# EAGLE design Tiny_BLE_V1.0 (EAGLE 6.4)
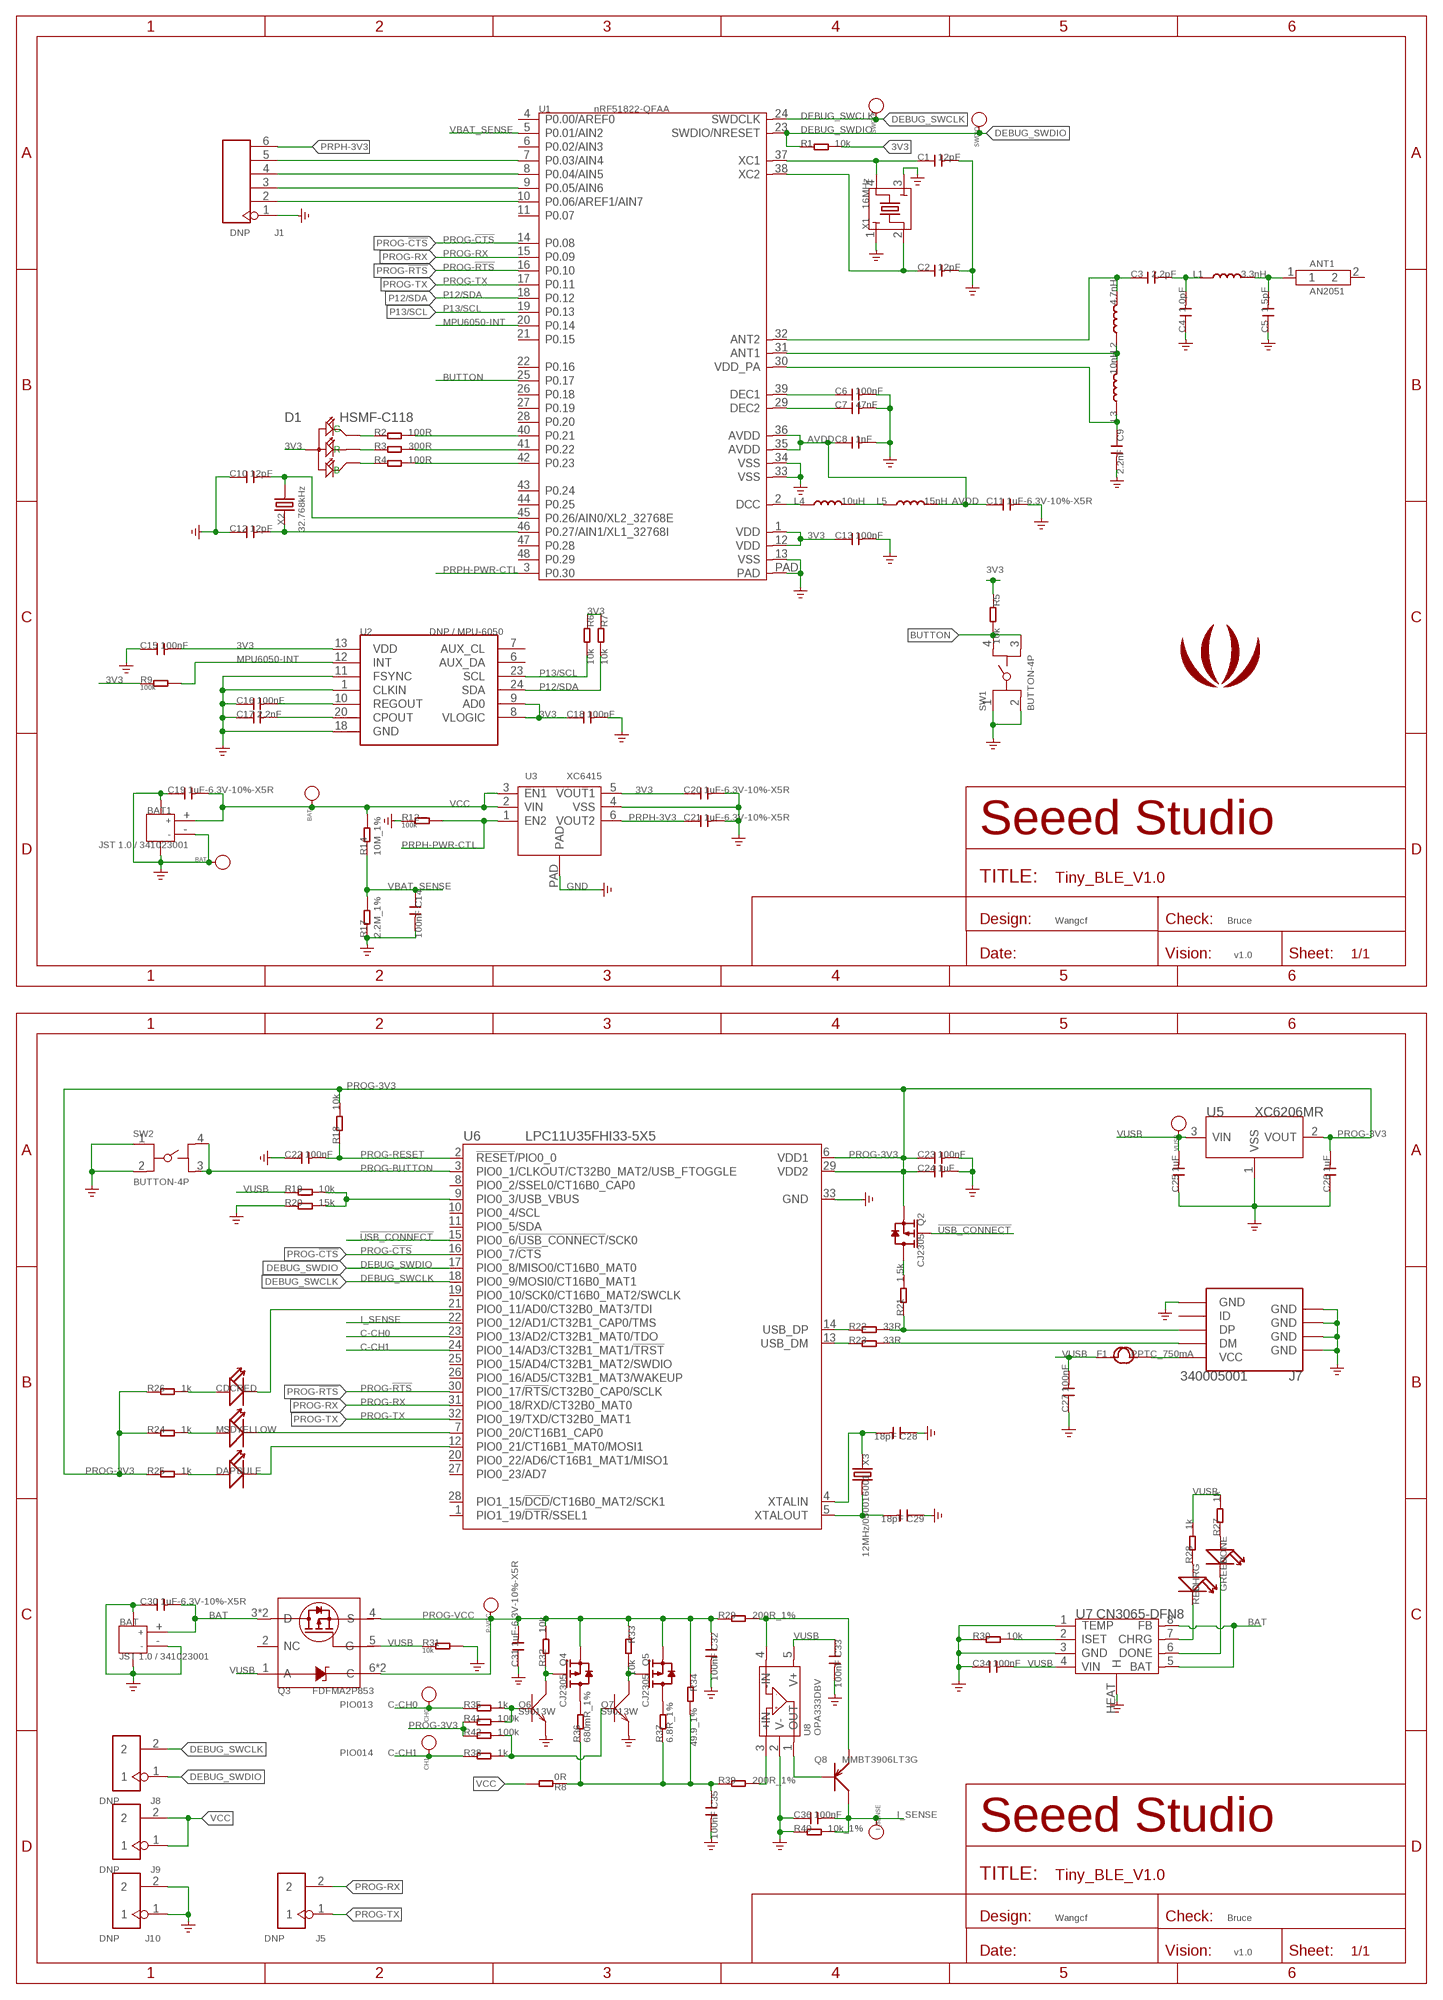
[diagram p0: schematic, sheet 1]

## Parts
ANT1  AN2051  ANTENNA-2.4GHZ-0.5DBI'AN2051'  [2P-SMD-L5.05*W.02*H1.07MM]
BAT  JST 1.0 / 341023001  JACK-JST-2P-SMD-PW'1.0'  [JST-SMD-2P-1.0-90D]
BAT1  JST 1.0 / 341023001  JACK-JST-2P-SMD-PW'1.0'  [JST-SMD-2P-1.0-90D]
BAT+  BAT+  PAD-TEST-POINT'4080'  [PAD_4080]
BAT-  BAT-  PAD-TEST-POINT'4080'  [PAD_4080]
C1  12pF  C-0402  [C0402]
C2  12pF  C-0402  [C0402]
C3  2.2pF  C-0402  [C0402]
C4  1.0pF  C-0402  [C0402]
C5  1.5pF  C-0402  [C0402]
C6  100nF  C-0402  [C0402]
C7  47nF  C-0402  [C0402]
C8  1nF  C-0402  [C0402]
C9  2.2nF  C-0402  [C0402]
C10  12pF  C-0402  [C0402]
C11  1uF-6.3V-10%-X5R  C-0402  [C0402]
C12  12pF  C-0402  [C0402]
C13  100nF  C-0402  [C0402]
C14  100nF  C-0402  [C0402]
C15  100nF  C-0402  [C0402]
C16  100nF  C-0402  [C0402]
C17  2.2nF  C-0402  [C0402]
C18  100nF  C-0402  [C0402]
C19  1uF-6.3V-10%-X5R  C-0402  [C0402]
C20  1uF-6.3V-10%-X5R  C-0402  [C0402]
C21  1uF-6.3V-10%-X5R  C-0402  [C0402]
C22  100nF  C-0402  [C0402]
C23  100nF  C-0402  [C0402]
C24  1uF  C-0402  [C0402]
C25  1uF  C-0402  [C0402]
C26  1uF  C-0402  [C0402]
C27  100nF  C-0402  [C0402]
C28  18pF  C-0402  [C0402]
C29  18pF  C-0402  [C0402]
C30  1uF-6.3V-10%-X5R  C-0402  [C0402]
C31  1uF-6.3V-10%-X5R  C-0402  [C0402]
C32  100nF  C-0402  [C0402]
C33  100nF  C-0402  [C0402]
C34  100nF  C-0402  [C0402]
C35  100nF  C-0402  [C0402]
C36  100nF  C-0402  [C0402]
CDC  RED  LED'0603'  [LED-0603]
CH0  CH0  PAD-TEST-POINT'4545'  [TP_4545]
CH1  CH1  PAD-TEST-POINT'4545'  [TP_4545]
CHRG  RED  LED'0603'  [LED-0603]
D1  HSMF-C118  LED-ARGB-4P-1210  [LED-4P-1210-3.0X2.54]
DAP  BULE  LED'0603'  [LED-0603]
DONE  GREEN  LED'0603'  [LED-0603]
F1  PPTC_750mA  FUSE'1206'  [F1206]
I_SENSE  I_SENSE  PAD-TEST-POINT'4545'  [TP_4545]
J1  DNP  HEADER-6P-60/35MIL  [6P-2.54-60/35MIL]
J5  DNP  HEADER-2P-65/35MIL  [2P-2.54-65/35MIL]
J7  340005001  USB-MINIUSB-5P-MICRO  [MICRO-USB]
J8  DNP  HEADER-2P-65/35MIL  [2P-2.54-65/35MIL]
J9  DNP  HEADER-2P-65/35MIL  [2P-2.54-65/35MIL]
J10  DNP  HEADER-2P-65/35MIL  [2P-2.54-65/35MIL]
L1  3.3nH  L'0402'  [L0402]
L2  4.7nH  L'0402'  [L0402]
L3  10nH  L'0402'  [L0402]
L4  10uH  L'0603'  [L0603]
L5  15nH  L'0402'  [L0402]
MSD  YELLOW  LED'0603'  [LED-0603]
P-VCC  P_VCC  PAD-TEST-POINT'4545'  [TP_4545]
Q2  CJ2305  MOSFET-P'SI2323CDS/SI2305DS<BR>'  [SOT23]
Q3  FDFMA2P853  [6P-SMD-W/-HEAT]
Q4  CJ2305  MOSFET-P'SI2323CDS/SI2305DS<BR>'  [SOT23]
Q5  CJ2305  MOSFET-P'SI2323CDS/SI2305DS<BR>'  [SOT23]
Q6  S9013W  TRANSISTOR-NPN-SOT323  [SOT323]
Q7  S9013W  TRANSISTOR-NPN-SOT323  [SOT323]
Q8  MMBT3906LT3G  TRANSISTOR-PNP-SOT23  [SOT23]
R1  10k  R-0402  [R0402]
R2  100R  R-0402  [R0402]
R3  300R  R-0402  [R0402]
R4  100R  R-0402  [R0402]
R5  10k  R-0402  [R0402]
R6  10k  R-0402  [R0402]
R7  10k  R-0402  [R0402]
R8  0R  R-0603  [R0603]
R9  100k  R-0402  [R0402]
R12  100k  R-0402  [R0402]
R14  10M_1%  R-0402  [R0402]
R17  2.2M_1%  R-0402  [R0402]
R18  10k  R-0402  [R0402]
R19  10k  R-0402  [R0402]
R20  15k  R-0402  [R0402]
R21  1.5k  R-0402  [R0402]
R22  33R  R-0402  [R0402]
R23  33R  R-0402  [R0402]
R24  1k  R-0402  [R0402]
R25  1k  R-0402  [R0402]
R26  1k  R-0402  [R0402]
R27  1k  R-0402  [R0402]
R28  1k  R-0402  [R0402]
R29  200R_1%  R-0402  [R0402]
R30  10k  R-0402  [R0402]
R31  10k  R-0402  [R0402]
R32  10k  R-0402  [R0402]
R33  10k  R-0402  [R0402]
R34  49.9_1%  R-0603  [R0603]
R35  1k  R-0402  [R0402]
R36  680mR_1%  R-0603  [R0603]
R37  6.8R_1%  R-0603  [R0603]
R38  1k  R-0402  [R0402]
R39  200R_1%  R-0402  [R0402]
R40  10k_1%  R-0402  [R0402]
R41  100k  R-0402  [R0402]
R42  100k  R-0402  [R0402]
SW1  BUTTON-4P  [4P-SMD-L4.45*W3.22*H2.5MM]
SW2  BUTTON-4P  [4P-SMD-L4.45*W3.22*H2.5MM]
SWCLK  SWDCLK  PAD-TEST-POINT'4080'  [PAD_4080]
SWDIO  SWDIO  PAD-TEST-POINT'4080'  [PAD_4080]
U1  nRF51822-QFAA  NRF51822  [QFN48-6X6MM]
U2  DNP / MPU-6050  MPU-6050‘’  [QFN24]
U3  XC6415  [USP-6C]
U5  XC6206MR  [SOT23]
U6  LPC11U35FHI33-5X5  [HVQFN33]
U7  CN3065-DFN8  [DFN8]
U8  OPA333DBV  [SOT23-5]
U$59  LOGO-SEEEDSTUDIO-SMALL-SILK  [SMALL_SEEED_LOGO]
VUSB  VUSB  PAD-TEST-POINT'4545'  [TP_4545]
X1  16MHz  CRYSTAL'-2520'  [2520]
X2  32.768kHz  CRYSTAL-3215  [2P-SMD-3.2X1.5]
X3  12MHz/050016001  CRYSTAL'5032'  [2P-SMD-5X3.2]

## Nets
3V3: C13.1 C15.2 C18.1 C20.1 D1.1(+) R1.2 R5.1 R6.1 R7.1 R9.1 U1.1(VDD) U1.12(VDD) U2.8(VLOGIC) U2.9(AD0) U2.13(VDD) U3.5(VOUT1)
!USB_CONNECT: Q2.1(G) U6.15(PIO0_6/!USB_CONNECT!/SCK0)
AVDD: C8.1 C11.1 L5.2 U1.35(AVDD) U1.36(AVDD)
BAT: BAT.+ C30.2 Q3.3(D) Q3.P2(D) U7.5(BAT) U7.8(FB)
BUTTON: R5.2 SW1.3 SW1.4 U1.25(P0.17)
C-CH0: CH0.T R35.1 U6.23(PIO0_13/AD2/CT32B1_MAT0/TDO)
C-CH1: CH1.T R38.1 U6.24(PIO0_14/AD3/CT32B1_MAT1/!TRST!)
CHRG: CHRG.- U7.7(CHRG)
CHRG-DONE: DONE.- U7.6(DONE)
DCC: L4.1 U1.2(DCC)
DEBUG_SWCLK: J8.2 SWCLK.1(T) U1.24(SWDCLK) U6.18(PIO0_9/MOSI0/CT16B0_MAT1)
DEBUG_SWDIO: J8.1 R1.1 SWDIO.1(T) U1.23(SWDIO/NRESET) U6.17(PIO0_8/MISO0/CT16B0_MAT0)
GND: BAT1.3 BAT1.4 BAT1.- BAT-.1(T) BAT.3 BAT.4 BAT.- C1.2 C2.2 C4.1 C5.1 C6.2 C7.2 C8.2 C9.2 C10.1 C11.2 C12.1 C13.2 C14.2 C15.1 C16.1 C17.1 C18.2 C19.1 C20.2 C21.2 C22.1 C23.2 C24.2 C25.1 C26.1 C27.1 C28.1 C29.1 C30.1 C31.1 C32.2 C33.2 C34.1 C35.2 C36.1 J1.1 J7.5(GND) J7.S1(GND) J7.S2(GND) J7.S3(GND) J7.S4(GND) J7.S5(GND) J7.S6(GND) J10.1 J10.2 Q6.2(E) Q7.2(E) R12.1 R17.1 R20.1 R30.1 R31.2 R40.1 SW1.1 SW1.2 SW2.1 SW2.2 U1.13(VSS) U1.33(VSS) U1.34(VSS) U1.PAD U2.1(CLKIN) U2.11(FSYNC) U2.18(GND) U3.4(VSS) U3.PAD U5.1(VSS) U6.33(GND) U7.1(TEMP) U7.3(GND) U7.HEAT(H) U8.2(V-) X1.1 X1.3 ; supply symbol labelled GND_POWER
I_SENSE: C36.2 I_SENSE.T Q8.3(C) R40.2 U6.22(PIO0_12/AD1/CT32B1_CAP0/TMS)
ISET: R30.2 U7.2(ISET)
MPU6050-INT: R9.2 U1.20(P0.14) U2.12(INT)
N$1: Q8.2(E) R29.2 U8.4(-IN)
N$2: C29.2 U6.5(XTALOUT) X3.2
N$3: D1.3(G) R2.1
N$4: C28.2 U6.4(XTALIN) X3.1
N$5: D1.2(R) R3.1
N$6: R22.1 U6.14(USB_DP)
N$7: R23.1 U6.13(USB_DM)
N$8: J7.3(DP) R21.1 R22.2
N$9: Q4.1(G) Q6.3(C) R32.1
N$11: J7.2(DM) R23.2
N$12: C10.2 U1.45(P0.26/AIN0/XL2_32768E) X2.2
N$13: C12.2 U1.46(P0.27/AIN1/XL1_32768I) X2.1
N$14: C1.1 U1.37(XC1) X1.4
N$15: C2.1 U1.38(XC2) X1.2
N$16: CDC.- U6.21(PIO0_11/AD0/CT32B0_MAT3/TDI)
N$19: C16.2 U2.10(REGOUT)
N$20: C6.1 U1.39(DEC1)
N$21: C17.2 U2.20(CPOUT)
N$25: C7.1 U1.29(DEC2)
N$26: C3.1 L2.2 U1.32(ANT2)
N$28: L2.1 L3.2 U1.31(ANT1)
N$29: C9.1 L3.1 U1.30(VDD_PA)
N$30: C3.2 C4.2 L1.1
N$31: ANT1.1 C5.2 L1.2
N$32: L4.2 L5.1
N$39: Q2.3(D) R21.2
N$40: F1.2 J7.1(VCC)
N$41: R19.2 R20.2 U6.9(PIO0_3/USB_VBUS)
N$42: CDC.+ R26.2
N$43: DAP.+ R25.2
N$44: MSD.+ R24.2
N$46: MSD.- U6.7(PIO0_20/CT16B1_CAP0)
N$47: DAP.- U6.12(PIO0_21/CT16B1_MAT0/MOSI1)
N$78: D1.4(B) R4.1
N$79: Q8.1(B) U8.1(OUT)
N$80: R39.2 U8.3(+IN)
N$81: Q5.3(D) R37.2
N$82: Q4.3(D) R36.2
N$83: Q6.1(B) R35.2 R41.2
N$84: Q5.1(G) Q7.3(C) R33.2
N$85: Q7.1(B) R38.2 R42.2
N$86: DONE.+ R27.1
N$87: CHRG.+ R28.1
N$88: R2.2 U1.40(P0.21)
N$89: R3.2 U1.41(P0.22)
N$90: R4.2 U1.42(P0.23)
N$93: J1.2 U1.10(P0.06/AREF1/AIN7)
N$94: J1.3 U1.9(P0.05/AIN6)
N$95: J1.4 U1.8(P0.04/AIN5)
N$96: J1.5 U1.7(P0.03/AIN4)
N$98: C35.1 R8.1 R34.2 R36.1 R37.1 R39.1
P12/SDA: R7.2 U1.18(P0.12) U2.24(SDA)
P13/SCL: R6.2 U1.19(P0.13) U2.23(SCL)
PROG-3V3: C23.1 C24.1 C26.2 Q2.2(S) R18.2 R24.1 R25.1 R26.1 R41.1 R42.1 U5.2(VOUT) U6.6(VDD1) U6.29(VDD2)
PROG-!CTS: U1.14(P0.08) U6.16(PIO0_7/!CTS!)
PROG-!RTS: U1.16(P0.10) U6.30(PIO0_17/!RTS!/CT32B0_CAP0/SCLK)
PROG-BUTTON: SW2.3 SW2.4 U6.3(PIO0_1/CLKOUT/CT32B0_MAT2/USB_FTOGGLE)
PROG-RESET: C22.2 R18.1 U6.2(!RESET!/PIO0_0)
PROG-RX: J5.2 U1.15(P0.09) U6.31(PIO0_18/RXD/CT32B0_MAT0)
PROG-TX: J5.1 U1.17(P0.11) U6.32(PIO0_19/TXD/CT32B0_MAT1)
PROG-VCC: C31.2 C32.1 P-VCC.T Q3.4(S) Q3.6(C) Q3.P1(C) Q4.2(S) Q5.2(S) R29.1 R32.2 R33.1 R34.1
PRPH-3V3: C21.1 J1.6 U3.6(VOUT2)
PRPH-PWR-CTL: R12.2 U1.3(P0.30) U3.1(EN2)
VBAT_SENSE: C14.1 R14.1 R17.2 U1.5(P0.01/AIN2)
VCC: BAT1.+ BAT+.1(T) C19.2 J9.1 J9.2 R8.2 R14.2 U3.2(VIN) U3.3(EN1)
VUSB: C25.2 C27.2 C33.1 C34.2 F1.1 Q3.1(A) Q3.5(G) R19.1 R27.2 R28.2 R31.1 U5.3(VIN) U7.4(VIN) U8.5(V+) VUSB.T
Unconnected: ANT1.2 J7.4(ID) Q3.2(NC) U1.4(P0.00/AREF0) U1.6(P0.02/AIN3) U1.11(P0.07) U1.21(P0.15) U1.22(P0.16) U1.26(P0.18) U1.27(P0.19) U1.28(P0.20) U1.43(P0.24) U1.44(P0.25) U1.47(P0.28) U1.48(P0.29) U2.6(AUX_DA) U2.7(AUX_CL) U6.1(PIO1_19/!DTR!/SSEL1) U6.8(PIO0_2/SSEL0/CT16B0_CAP0) U6.10(PIO0_4/SCL) U6.11(PIO0_5/SDA) U6.19(PIO0_10/SCK0/CT16B0_MAT2/SWCLK) U6.20(PIO0_22/AD6/CT16B1_MAT1/MISO1) U6.25(PIO0_15/AD4/CT32B1_MAT2/SWDIO) U6.26(PIO0_16/AD5/CT32B1_MAT3/WAKEUP) U6.27(PIO0_23/AD7) U6.28(PIO1_15/!DCD!/CT16B0_MAT2/SCK1)

## Notes on the sheet
- Wangcf | Bruce
- v1.0
- PIO013
- PIO014
- Wangcf | Bruce
- v1.0

## Library data of the parts
ANT1 = Connector:ANTENNA-2.4GHZ-0.5DBI: AN2051 Multilayer Chip Antenna for 2.4GHz Wireless Communication
BAT BAT1 = Connector :JACK-JST-2P-SMD-PW
BAT+ BAT- SWCLK SWDIO = Discrete:PAD-TEST-POINT
C1-C36 = Discrete:C*: Ceramic Capacitors
CDC CHRG DAP DONE MSD = Discrete:LED*
CH0 CH1 I_SENSE P-VCC VUSB = Discrete:PAD-TEST-POINT; PARTNO: DNP
D1 = Discrete:LED-ARGB*-4P
F1 = Discrete:FUSE
J1 = Connector:HEADER-6P
J5 J8-J10 = Connector:HEADER-2P
J7 = Connector :USB-MINIUSB-5P
L1-L5 = Discrete:L*
Q2 Q4 Q5 = Discrete:MOSFET-P
Q3 = template:FDFMA2P853: Integrated P-Channel Power Trench MOSFET and Schottky Diode
Q6 Q7 = Discrete:TRANSISTOR-NPN*: NPN audion
Q8 = Discrete:TRANSISTOR-PNP*: PNP audion
R1-R9 R12 R14 R17-R42 = Discrete:R*
SW1 SW2 = template:BUTTON-4P
U1 = AMLib:NRF51822: Multi-protocol Blutooth 4.0 low energy /2. GHz RF SoC
U2 = template:MPU-6050
U3 = template :XC6415: Dual LDO Regulator with ON/OFF Switch
U5 = IC:XC6206: LOW ESR Cap.Compatible Positive Voltage Regulators
U6 = AMLib:LPC11U35FHI33
U7 = IC:CN3065: USB-Compatible Lithiumt-Ion Battery Charger with Thermal Regulation http://www.consonance-elec.com/pdf/%E6%8A%80%E6%9C%AF%E8%AF%B4%E6%98%8E%E4%B9%A6/DSC-CN3065.pdf
U8 = IC:OPA333: 1.8V,Micro power CMOS oprational amplifiers Zero-Drift Series http://www.ti.com.cn/cn/lit/ds/symlink/opa333.pdf
U$59 = Logo:LOGO-SEEEDSTUDIO; PARTNO: DNP
X1 = AMLib:CRYSTAL
X2 X3 = Discrete:CRYSTAL*: CRYSTAL

## Net classes
0 default: width 0.102 mm, drill 0.203 mm, clearance 0.102 mm

## Board
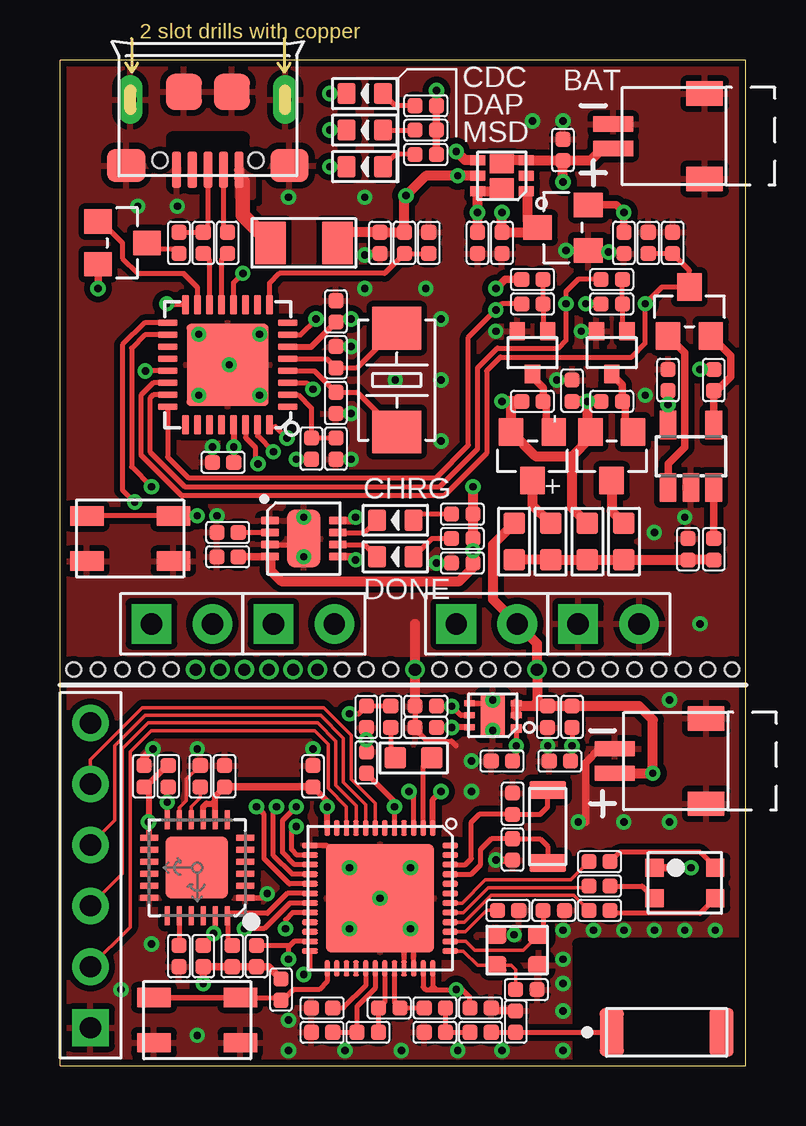
[diagram p1: board, top side]
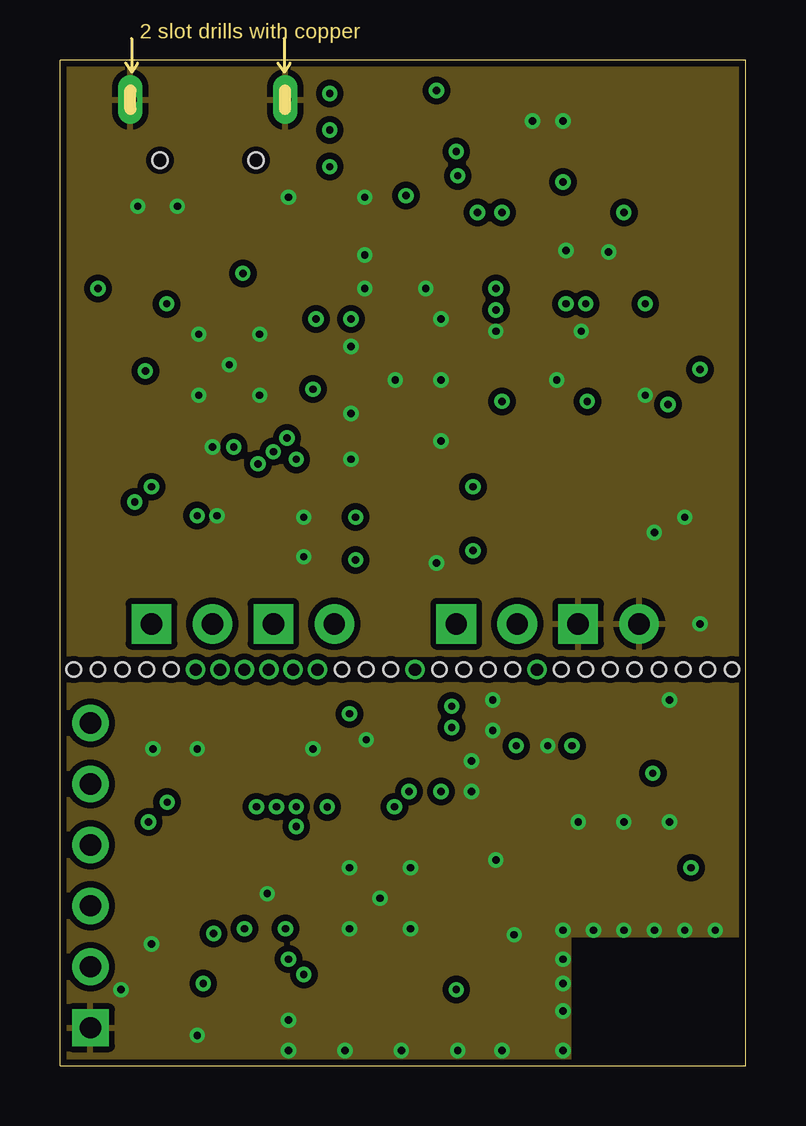
[diagram p2: board, inner layer GND]
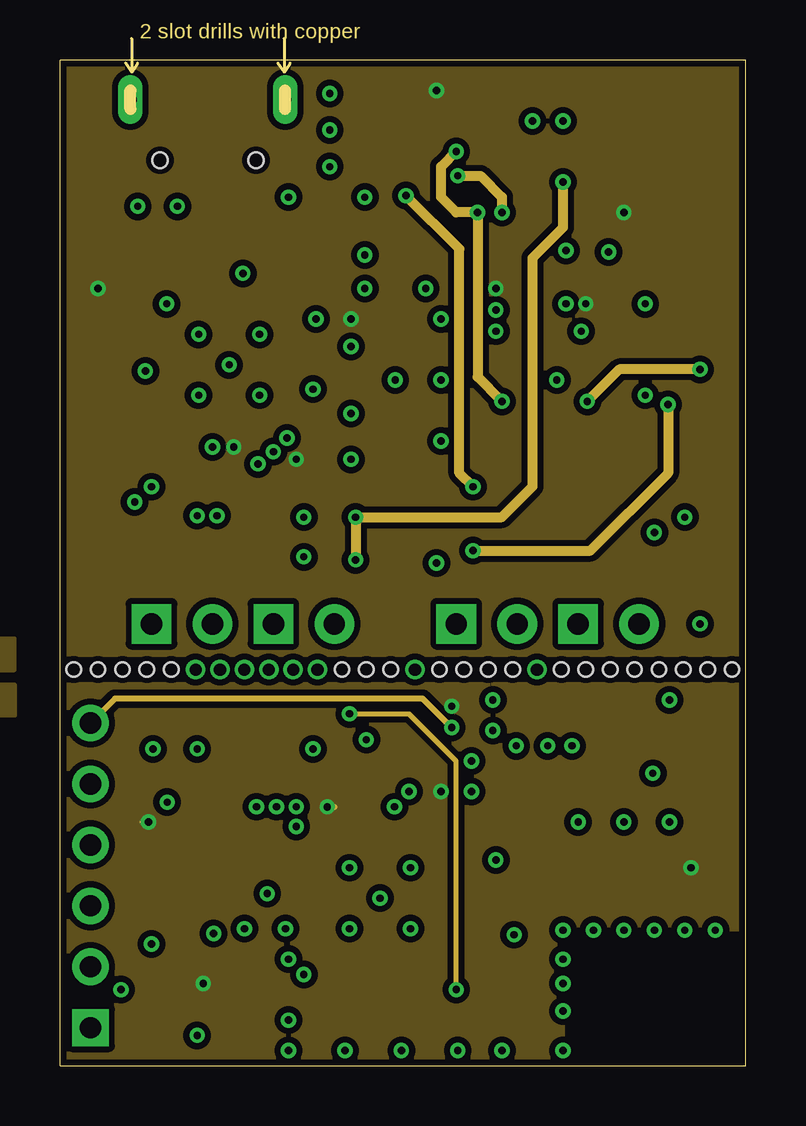
[diagram p3: board, inner layer POWER]
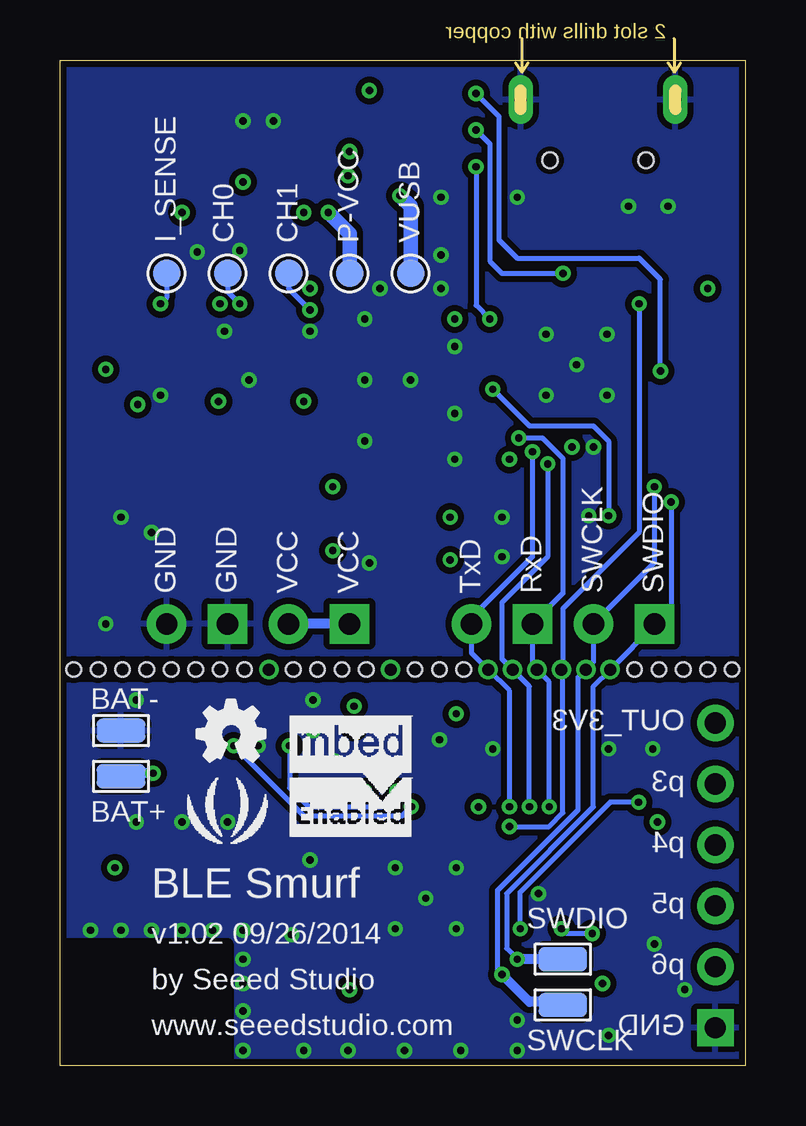
[diagram p4: board, bottom side, seen from below]

Size 28.58 x 41.91 mm. Coordinates in mm from the lower left corner, seen from the top.
Outline: 0,0 28.58,0 28.58,41.91 0,41.91 0,0
Copper layers (1*2*15*16): Top 0.035mm / dielectric 0.2mm / GND 0.0175mm / dielectric 0.3mm / POWER 0.0175mm / dielectric 0.2mm / Bottom 0.035mm
Design rules "default": minimum track width 6mil, minimum drill 12mil, track to track 6mil, track to pad 6mil, pad to pad 6mil, via to via 6mil, smd to smd 0mil, copper to edge 6mil, drill to drill 10mil, minimum pad ring 6mil, minimum via ring 6mil, stop-mask expansion 2mil, vias tented up to drill 25mil, thermal gap 10mil
Holes 0.6 mm at 28,16.51 26.99,16.51 25.97,16.51 24.96,16.51 23.94,16.51 22.92,16.51 21.91,16.51 20.89,16.51 18.86,16.51 17.84,16.51 16.83,16.51 15.81,16.51 13.78,16.51 12.76,16.51 11.75,16.51 4.64,16.51 3.62,16.51 2.6,16.51 1.59,16.51 0.57,16.51
tRestrict: area 21.6,0 to 28.6,5.1; area 14.4,3.9 to 14.7,4.2
bRestrict: area 21.6,0 to 28.6,5.1

### Footprints (pad centres in the part's own frame; a part is rotated, then mirrored left to right if it is on the bottom)
2P-SMD-L5.05*W.02*H1.07MM = smd 1.016 x 2.032: 1 -2.286,0; 2 2.286,0
JST-SMD-2P-1.0-90D = smd 1.524 x 1.016: 3 -3.429,1.778; 4 -3.429,-1.778 | smd 1.651 x 0.635: + 0.381,0.508; - 0.381,-0.508
PAD_4080 = smd 2.032 x 1.016: 1 0,0
C0402 = smd 0.635 x 0.635: 1 -0.445,0; 2 0.445,0
LED-0603 = smd 0.762 x 0.889: + -0.762,0; - 0.762,0
TP_4545 = smd 1.143 x 1.143: T 0,0
LED-4P-1210-3.0X2.54 = smd 0.762 x 0.762: 1 -0.635,-1.27; 2 0.635,-1.27; 3 0.635,1.27; 4 -0.635,1.27
F1206 = smd 1.27 x 1.778: 1 -1.397,0; 2 1.397,0
6P-2.54-60/35MIL = drill 0.889 pad 1.524 square: 1 0,6.35 | drill 0.889 pad 1.524: 2 0,3.81; 3 0,1.27; 4 0,-1.27; 5 0,-3.81; 6 0,-6.35
2P-2.54-65/35MIL = drill 0.889 pad 1.651 square: 1 0,1.27 | drill 0.889 pad 1.651: 2 0,-1.27
MICRO-USB = smd 0.381 x 1.524: 1 -1.3,-0.25; 2 -0.65,-0.25; 3 0,-0.25; 4 0.65,-0.25; 5 1.3,-0.25 | smd 1.6 x 1.397: S1 -3.4,-0.427; S6 3.4,-0.427 | drill 0.508 pad 1.016 long: S2 -3.226,-3.175; S5 3.226,-3.175 | smd 1.5 x 1.5: S3 -1,-3.5; S4 1,-3.5 | hole 0.635: -2,-0.65; 2,-0.65
L0402 = smd 0.635 x 0.635: 1 -0.445,0; 2 0.445,0
L0603 = smd 0.889 x 0.889: 1 -0.762,0; 2 0.762,0
SOT23 = smd 1.016 x 1.143: 1 -0.889,-1.016; 2 0.889,-1.016; 3 0,1.016
6P-SMD-W/-HEAT = smd 0.42 x 0.62: 1 -0.65,-1.015; 2 0,-1.015; 3 0.65,-1.015; 4 0.65,1.015; 5 0,1.015; 6 -0.65,1.015 | smd 0.8 x 1: P1 -0.508,0; P2 0.5,0
SOT323 = smd 0.635 x 0.762: 1 -0.635,-0.889; 2 0.635,-0.889; 3 0,0.889
R0402 = smd 0.635 x 0.635: 1 -0.445,0; 2 0.445,0
R0603 = smd 0.889 x 0.889: 1 -0.762,0; 2 0.762,0
4P-SMD-L4.45*W3.22*H2.5MM = smd 1.4 x 0.8: 1 -1.8,-0.94; 2 1.8,-0.94; 3 1.8,0.94; 4 -1.8,0.94
QFN48-6X6MM = smd 0.23 x 0.65: 1 -2.2,-2.925; 2 -1.8,-2.925; 3 -1.4,-2.925; 4 -1,-2.925; 5 -0.6,-2.925; 6 -0.2,-2.925; 7 0.2,-2.925; 8 0.6,-2.925; 9 1,-2.925; 10 1.4,-2.925; 11 1.8,-2.925; 12 2.2,-2.925; 25 2.2,2.925; 26 1.8,2.925; 27 1.4,2.925; 28 1,2.925; 29 0.6,2.925; 30 0.2,2.925; 31 -0.2,2.925; 32 -0.6,2.925; 33 -1,2.925; 34 -1.4,2.925; 35 -1.8,2.925; 36 -2.2,2.925 | smd 0.65 x 0.23: 13 2.925,-2.2; 14 2.925,-1.8; 15 2.925,-1.4; 16 2.925,-1; 17 2.925,-0.6; 18 2.925,-0.2; 19 2.925,0.2; 20 2.925,0.6; 21 2.925,1; 22 2.925,1.4; 23 2.925,1.8; 24 2.925,2.2; 37 -2.925,2.2; 38 -2.925,1.8; 39 -2.925,1.4; 40 -2.925,1; 41 -2.925,0.6; 42 -2.925,0.2; 43 -2.925,-0.2; 44 -2.925,-0.6; 45 -2.925,-1; 46 -2.925,-1.4; 47 -2.925,-1.8; 48 -2.925,-2.2 | smd 4.5 x 4.5: PAD 0,0
QFN24 = smd 0.8 x 0.26: 1 -2,1.25; 2 -2,0.75; 3 -2,0.25; 4 -2,-0.25; 5 -2,-0.75; 6 -2,-1.25; 13 2,-1.25; 14 2,-0.75; 15 2,-0.25; 16 2,0.25; 17 2,0.75; 18 2,1.25 | smd 0.26 x 0.8: 7 -1.25,-2; 8 -0.75,-2; 9 -0.25,-2; 10 0.25,-2; 11 0.75,-2; 12 1.25,-2; 19 1.25,2; 20 0.75,2; 21 0.25,2; 22 -0.25,2; 23 -0.75,2; 24 -1.25,2 | smd 2.6 x 2.6: E 0.02,-0.01
USP-6C = smd 0.45 x 0.35: 1 -0.975,0.55 | smd 0.45 x 0.25: 2 -0.975,0; 3 -0.975,-0.5; 4 0.975,-0.5; 5 0.975,0; 6 0.975,0.5 | smd 1 x 1.8: PAD 0,0
SOT23' = smd 1.016 x 1.2: 1 -0.95,-1.06; 2 0.95,-1.06; 3 0,1.06
HVQFN33 = smd 0.813 x 0.279: 1 -2.5,1.75; 2 -2.5,1.25; 3 -2.5,0.75; 4 -2.5,0.25; 5 -2.5,-0.25; 6 -2.5,-0.75; 7 -2.5,-1.25; 8 -2.5,-1.75; 17 2.5,-1.75; 18 2.5,-1.25; 19 2.5,-0.75; 20 2.5,-0.25; 21 2.5,0.25; 22 2.5,0.75; 23 2.5,1.25; 24 2.5,1.75 | smd 0.279 x 0.813: 9 -1.75,-2.5; 10 -1.25,-2.5; 11 -0.75,-2.5; 12 -0.25,-2.5; 13 0.25,-2.5; 14 0.75,-2.5; 15 1.25,-2.5; 16 1.75,-2.5; 25 1.75,2.5; 26 1.25,2.5; 27 0.75,2.5; 28 0.25,2.5; 29 -0.25,2.5; 30 -0.75,2.5; 31 -1.25,2.5; 32 -1.75,2.5 | smd 3.429 x 3.429: 33 0,0
DFN8 = smd 0.3 x 0.727: 1 -0.75,-1.413; 2 -0.25,-1.413; 3 0.25,-1.413; 4 0.75,-1.413; 5 0.75,1.413; 6 0.25,1.413; 7 -0.25,1.413; 8 -0.75,1.413 | smd 2.413 x 1.397: HEAT 0,0
SOT23-5 = smd 0.69 x 1.2: 1 -0.95,-1.3; 2 0,-1.3; 3 0.95,-1.3; 4 0.95,1.3; 5 -0.95,1.3
2520 = smd 0.889 x 0.762: 1 -0.889,0.635; 2 -0.889,-0.635; 3 0.889,-0.635; 4 0.889,0.635
2P-SMD-3.2X1.5 = smd 0.762 x 1.524: 1 -1.524,0; 2 1.524,0
2P-SMD-5X3.2 = smd 1.778 x 2.032: 1 -2.159,0; 2 2.159,0

### Placement (x,y rotation side)
ANT1  25.27,1.4 0 top
BAT  23.43,38.73 180 top
BAT1  23.49,12.7 180 top
BAT+  26.03,12.06 0 bottom
BAT-  26.03,13.97 0 bottom
C1  19.43,3.17 0 top
C2  20.57,6.48 0 top
C3  15.62,2.41 0 top
C4  15.62,1.4 0 top
C5  18.99,1.84 270 top
C6  18.67,6.48 0 top
C7  10.92,2.41 180 top
C8  17.53,2.41 0 top
C9  10.92,1.4 180 top
C10  18.86,9.02 90 top
C11  12.76,14.54 270 top
C12  18.86,10.92 270 top
C13  10.54,12.06 90 top
C14  12.76,12.64 90 top
C15  3.49,12.06 270 top
C16  5.84,12.06 270 top
C17  4.95,4.57 90 top
C18  6.86,12.06 90 top
C19  20.32,14.54 90 top
C20  15.24,14.99 180 top
C21  15.24,14.1 180 top
C22  11.49,25.72 90 top
C23  11.49,31.43 90 top
C24  6.79,25.15 180 top
C25  18.41,34.29 90 top
C26  23.49,34.29 90 top
C27  13.33,34.29 90 top
C28  11.49,27.62 90 top
C29  11.49,29.53 270 top
C30  20.95,38.16 270 top
C31  17.4,34.29 90 top
C32  21.34,28.13 90 top
C33  25.34,28.57 90 top
C34  6.98,21.21 0 top
C35  26.16,21.53 90 top
C36  25.53,34.29 270 top
CDC  12.7,40.51 180 top
CH0  21.59,33.02 0 bottom
CH1  19.05,33.02 0 bottom
CHRG  13.97,22.73 180 top
D1  26.03,7.62 270 top
DAP  12.7,38.99 180 top
DONE  13.97,21.21 180 top
F1  10.16,34.29 180 top
I_SENSE  24.13,33.02 0 bottom
J1  1.27,7.94 180 top
J5  10.16,18.41 90 top
J7  6.16,37.08 180 top
J8  5.08,18.41 90 top
J9  17.78,18.41 90 top
J10  22.86,18.41 90 top
L1  17.53,1.4 0 top
L2  13.72,2.41 0 top
L3  12.83,1.4 0 top
L4  14.73,12.83 180 top
L5  13.78,14.54 90 top
MSD  12.7,37.46 180 top
P-VCC  16.51,33.02 0 bottom
Q2  2.6,34.29 270 top
Q3  18.41,37.08 90 top
Q4  22.99,25.4 180 top
Q5  19.69,25.4 180 top
Q6  22.99,29.72 180 top
Q7  19.69,29.72 180 top
Q8  26.23,31.43 0 top
R1  8.19,4.57 270 top
R2  22.48,6.48 180 top
R3  22.48,7.49 180 top
R4  22.48,8.51 180 top
R5  9.21,3.17 270 top
R6  5.97,4.57 90 top
R7  7.18,4.57 90 top
R8  18.92,21.84 90 top
R9  4.51,12.06 270 top
R12  18.41,12.7 0 top
R14  21.34,14.54 90 top
R17  20.83,12.7 0 top
R18  10.48,25.72 270 top
R19  14.35,34.29 270 top
R20  15.37,34.29 270 top
R21  4.95,34.29 270 top
R22  5.97,34.29 90 top
R23  6.98,34.29 90 top
R24  15.24,37.97 180 top
R25  15.24,38.99 180 top
R26  15.24,40 180 top
R27  16.76,21.97 0 top
R28  16.76,22.99 0 top
R29  27.24,28.57 270 top
R30  6.98,22.22 0 top
R31  16.76,20.95 180 top
R32  22.99,27.69 180 top
R33  19.69,27.69 0 top
R34  21.97,21.84 270 top
R35  22.99,32.77 0 top
R36  23.49,21.84 90 top
R37  20.45,21.84 90 top
R38  19.69,31.75 0 top
R39  27.24,21.53 90 top
R40  24.51,34.29 270 top
R41  22.99,31.75 0 top
R42  19.69,32.77 0 top
SW1  5.72,1.9 0 top
SW2  2.92,21.97 0 top
SWCLK  7.62,2.54 180 bottom
SWDIO  7.62,4.45 180 bottom
U1  13.33,6.98 180 top
U2  5.72,8.25 180 top
U3  18.03,14.6 180 top
U5  XC6206MR  [SOT23']  20.95,34.92 90 top
U6  6.98,29.21 180 top
U7  10.16,21.97 270 top
U8  26.29,25.4 0 top
U$30  [OSHW_FILLX100_NOTEXT]  22.86,12.7 0 bottom
U$59  21.59,10.79 0 bottom
VUSB  13.97,33.02 0 bottom
X1  19.05,4.83 180 top
X2  20.32,9.97 270 top
X3  14.03,28.57 90 top

### Tracks (layer width: path | path; a pad name or v marks a point on that pad's centre or on a via)
3V3  (via drill 0.3 pad 0.64)
  Top 0.203: 3.72,11.72 3.65,11.72 | 4.38,12.32 4.38,12.38 R9.1 | 16.83,14.6 U3.5 16.7,14.6 v16.32,14.99 C20.1
  Top 0.254: U1.12 v11.13,10.79 11.13,11.03 C13.1 | U2.8 6.47,10.81 | 6.47,10.81 6.47,10.92 | 6.47,10.92 6.47,11.23 C18.1 | U2.9 5.97,10.79 6.1,10.92 6.35,10.92 | 6.35,10.92 6.47,10.92 | 6.35,10.92 6.41,10.99 | 6.47,10.81 6.35,10.92 | U2.13 3.72,10.19 | 3.72,10.19 3.72,11.72 3.72,11.78 4.25,12.32 4.38,12.32 | 3.72,10.19 v3.68,10.16 | U1.1 15.53,11.09 v15.88,11.43
  Top 0.305: C13.1 C18.1 | R1.2 R7.1 R6.1 v5.97,3.43 | R1.2 8.25,4.13 | D1.1 v26.29,8.25 | 3.65,11.72 3.59,11.72 C15.2 | R1.2 8.7,4.13 R5.1
  POWER 0.254: 11.43,10.79 | v3.68,10.16 3.43,10.16
  pour POWER: -3.17,15.87 -1.91,15.87 -1.91,14.6 -3.17,14.6
  pour POWER (isolate 0.254): 0,0 20.95,0 20.95,5.71 29.84,5.71 29.84,15.87 0,15.87
!USB_CONNECT
  Top 0.203: Q2.1 1.72,35.18 2.6,34.29 2.6,33.66 3.24,33.02 5.14,33.02 5.73,32.43 U6.15
AVDD  (via drill 0.3 pad 0.64)
  Top 0.203: U1.35 15.13,3.28 15.24,3.17 15.43,3.17 | 15.43,3.17 15.49,3.17 | 15.49,3.17 15.69,3.17 | 15.69,3.17 v16.51,3.17 16.76,3.17 17.08,2.86 C8.1 | U1.36 15.53,3.32 | 15.53,3.28 15.53,3.22 15.49,3.17 | 15.53,3.32 15.53,3.28 | 15.53,3.28 15.43,3.17 | 15.53,3.32 15.69,3.17 | L5.2 C11.1 12.45,14.67 v12.06,14.67
  POWER 0.203: v16.51,3.17 16.51,12.7 14.54,14.67 v12.06,14.67
BAT  (via drill 0.3 pad 0.64)
  Top 0.254: C30.2 20.94,37.73
  Top 0.305: U7.8 12.18,22.72 v12.32,22.86 | U7.5 12.18,21.22 v12.32,21.08
  Top 0.406: Q3.P2 18.56,37.73 Q3.3 20.94,37.73 22.11,37.73 22.61,38.23 BAT.+ | v20.95,36.83 C30.2
  POWER 0.406: v20.95,36.83 20.95,34.92 19.69,33.66 19.69,24.13 18.41,22.86 v12.32,22.86 v12.32,21.08
BUTTON
  Top 0.203: SW1.3 SW1.4 9.09,2.84 R5.2 9.27,2.79 9.33,2.79 9.72,3.17 10.8,3.17 11.13,3.52 U1.25
C-CH0  (via drill 0.3 pad 0.64)
  Top 0.203: U6.23 3.89,27.96 3.75,27.81 3.75,25.59 5.21,24.13 15.82,24.13 17.4,25.71 17.4,29.08 18.22,29.91 20.77,29.91 21.08,30.23 v21.08,31.75 21.08,32.26 21.59,32.77 R35.1
  Bottom 0.203: 21.34,33.02 CH0.T 21.59,32.26 v21.08,31.75
C-CH1  (via drill 0.3 pad 0.64)
  Top 0.203: U6.24 4.48,25.36 5.33,24.51 15.67,24.51 17.02,25.86 17.02,30.35 v18.16,31.5 18.41,31.75 R38.1
  Bottom 0.203: CH1.T 19.05,32.38 v18.16,31.5
CHRG
  Top 0.203: U7.7 12.7,22.22 CHRG.-
CHRG-DONE
  Top 0.203: U7.6 12.7,21.72 DONE.-
DCC
  Top 0.203: U1.2 15.13,12.47 L4.1
DEBUG_SWCLK  (via drill 0.3 pad 0.64, 0.51 pad 0.76)
  Top 0.203: U1.24 10.41,4.06 v10.16,3.81 | U6.18 3.54,30.46 2.98,29.91 2.98,24.95 v3.81,24.13
  Bottom 0.203: v10.16,3.81 10.35,4 10.35,7.3 6.98,10.67 6.98,16.19 v6.67,16.51 6.35,16.83 J8.2 3.81,20.95 v3.81,24.13
  Bottom 0.406: SWCLK.1 8.25,2.54 8.25,2.67 9.02,2.67 v10.16,3.81
DEBUG_SWDIO  (via drill 0.3 pad 0.64, 0.51 pad 0.76)
  Top 0.203: U1.23 9.76,5.18 9.59,5.02 | 9.59,5.02 9.52,4.95 v9.52,4.45 | R1.1 9.59,5.02 | U6.17 3.53,30.96 2.6,30.03 2.6,24 v3.11,23.49
  Bottom 0.203: v9.52,4.45 9.97,4.89 9.97,7.18 6.35,10.79 6.35,15.81 v5.65,16.51 3.81,18.35 J8.1 3.11,19.11 v3.11,23.49
  Bottom 0.406: SWDIO.1 v9.52,4.45
GND  (via drill 0.3 pad 0.64, 0.51 pad 0.76)
  Top 0.152: U2.11 4.97,10.74 5.27,11.05 5.27,11.94 C16.1
  Top 0.203: U1.13 11.13,9.18 11.43,8.89 11.56,8.89 12.19,8.25 v12.06,8.25 | U1.33 14.33,5.35 | 14.33,5.35 13.97,5.71 | 14.73,5.08 U1.34 14.73,5.59 v14.61,5.71 14.33,5.45 14.33,5.35 | U7.3 10.04,21.72 10.16,21.84 U7.HEAT | C16.1 5.78,12.51 | U2.1 8.47,7 v8.64,7.18 | U3.4 18.03,15.1 v18.03,15.24 | C20.2 14.8,14.16 | 14.8,14.16 14.86,14.1 | 14.8,14.16 14.8,14.03 15.3,13.52 16.32,13.52 16.51,13.33
  Top 0.305: C5.1 18.1,2.29 C8.2 | C10.1 v18.16,8.57 | C11.2 12.64,14.1 | 20.45,13.97 C19.1 | C15.1 3.49,12.83 v3.87,13.21 | C27.1 12.76,33.85 v12.7,33.78 | BAT1.- 22.48,13.21 21.91,12.64 21.91,10.16
  Top 0.406: C20.2 v14.8,16.51 14.8,18.41
  other vias: 17.14,11.43 18.16,30.61 20.95,2.29 20.95,3.43 20.95,4.45 20.95,5.65 22.22,5.65 23.49,5.65 24.77,5.65 26.03,5.65 27.3,5.65 20.32,13.33 18.03,13.97 21.59,10.16 23.49,10.16 25.4,10.16 18.92,5.46 13.33,6.98 14.61,8.25 12.06,5.71 5.72,1.27 2.54,3.17 7.05,29.21 5.78,27.94 8.32,27.94 8.32,30.48 5.78,30.48 6.35,25.78 21.72,30.61 26.03,22.86 13.97,28.57 15.88,28.57 15.88,31.11 12.13,29.97 10.16,22.86 10.16,21.21 6.54,22.92 20.7,28.57 15.88,26.03 5.72,13.21 4.89,35.81 3.24,35.81 24.77,22.22 26.67,18.41 9.52,1.9 12.13,27.18 12.13,25.27 12.76,13.59 17.14,12.7 10.54,13.21 9.52,0.63 11.87,0.63 14.22,0.63 16.57,0.63 18.41,0.63 20.95,0.63 15.68,20.95 21.08,33.97 22.86,33.91 12.7,32.38 9.52,36.2 12.7,36.2 20.95,39.37 19.69,39.37 15.24,32.38 24.38,27.94 3.81,5.08 25.4,15.24
  pour GND: -5.08,15.87 -3.81,15.87 -3.81,14.6 -5.08,14.6
  pour Top (isolate 0.254, rank 6): 0,15.87 28.58,15.87 28.58,0 0,0
  pour Bottom (isolate 0.254, rank 6): 0,15.87 28.58,15.87 28.58,0 0,0
  pour GND (isolate 0.254): 0,0 21.21,0 21.21,5.46 29.21,5.46 29.21,15.87 0,15.87
  pour GND (isolate 0.254): 0,17.14 29.21,17.14 29.21,41.91 0,41.91
  pour Top (isolate 0.254, rank 2): 0,17.14 28.58,17.14 28.58,41.91 0,41.91
  pour Bottom (isolate 0.254): 0,17.14 28.58,17.14 28.58,41.91 0,41.91
I_SENSE  (via drill 0.3 pad 0.64)
  Top 0.203: U6.22 3.88,28.46 3.37,27.94 3.37,25.46 5.08,23.75 16,23.75 17.78,25.53 17.78,28.96 18.35,29.53 23.81,29.53 24.38,30.1 v24.38,31.75 25.08,32.45 Q8.3 26.22,33.15 C36.2 R40.2
  Bottom 0.203: I_SENSE.T 24.13,32 v24.38,31.75
ISET
  Top 0.203: U7.2 R30.2
MPU6050-INT  (via drill 0.3 pad 0.64)
  Top 0.203: U1.20 9.69,6.38 9.4,6.1 v9.4,5.71 | U2.12 v4.47,10.99 4.47,11.51
  Top 0.254: 4.47,11.51 4.47,11.58 R9.2
  Bottom 0.203: v4.47,10.99 5.65,10.99 9.4,7.24 v9.4,5.71
N$1
  Top 0.305: U8.4 R29.2 27.37,28.13 27.94,28.7 27.94,29.59 Q8.2
N$2
  Top 0.203: U6.5 11.12,29.46 C29.2 12.38,29.08 X3.2
N$3
  Top 0.203: D1.3 26.67,6.35 23.05,6.35 R2.1
N$4
  Top 0.203: U6.4 10.6,28.96 C28.2 12.38,28.07 X3.1
N$5
  Top 0.203: R3.1 24.26,7.49 D1.2
N$6
  Top 0.203: U6.14 6.23,33.58 R22.1
N$7
  Top 0.203: U6.13 6.73,33.6 R23.1
N$8
  Top 0.203: R21.1 R22.2 6.16,34.92 J7.3
N$9
  Top 0.305: Q6.3 23.43,28.38 R32.1 23.56,27.69 23.56,26.73 Q4.1
N$11
  Top 0.203: J7.2 6.81,34.91 R23.2
N$12
  Top 0.203: U1.45 17.13,7.98 17.53,8.38 17.53,9.02 17.97,9.46 C10.2 20,9.46 20.32,9.14 X2.2 20.32,8.25
N$13
  Top 0.203: U1.46 16.89,8.38 17.14,8.64 17.14,10.16 17.46,10.48 C12.2 20,10.48 20.32,10.79 X2.1
N$14
  Top 0.152: U1.37 16.8,4.78 17.4,4.19 X1.4 18.8,4.19 18.99,4 C1.1
N$15
  Top 0.152: X1.2 19.3,4.83 17.27,4.83 16.91,5.18 U1.38
  Top 0.203: C2.1 20.13,5.65 X1.2
N$16  (via drill 0.3 pad 0.64)
  Top 0.203: CDC.- v11.24,40.51 | U6.21 v3.56,28.96
  Bottom 0.203: v11.24,40.51 10.29,39.56 10.29,34.42 9.52,33.66 4.44,33.66 3.56,32.77 v3.56,28.96
N$19
  Top 0.152: C16.2 5.84,11.18 5.47,10.8 U2.10
N$20
  Top 0.152: U1.39 16.89,5.59 17.78,6.48 C6.1
N$21
  Top 0.203: U2.20 4.97,5.03 C17.2
N$25
  Top 0.203: U1.29 12.73,3.34 11.81,2.41 C7.1
N$26
  Top 0.203: U1.32 13.94,2.64 L2.2 C3.1
N$28
  Top 0.203: L3.2 L2.1 13.53,2.68 U1.31
N$29
  Top 0.203: C9.1 L3.1 12.38,2.48 13.13,3.23 U1.30
N$30
  Top 0.203: L1.1 C4.2 C3.2
N$31
  Top 0.203: L1.2 C5.2 ANT1.1
N$32
  Top 0.203: L5.1 13.78,13.02 L4.2
N$39
  Top 0.203: Q2.3 3.62,34.04 4.76,34.04 R21.2
N$40
  Top 0.406: J7.1 7.46,36.99 7.62,36.83
  Top 0.61: 7.62,36.83 7.62,35.43 F1.2
  pour Top (isolate 0.254, no thermals): 7.37,38.1 7.37,36.2 8.06,36.2 8.06,38.1
N$41
  Top 0.203: R20.2 R19.2 13.52,33.02 9.14,33.02 8.73,32.61 U6.9
N$42
  Top 0.203: R26.2 13.97,40 CDC.+
N$43
  Top 0.203: DAP.+ R25.2
N$44
  Top 0.203: R24.2 13.97,37.97 MSD.+
N$46  (via drill 0.3 pad 0.64)
  Top 0.203: U6.7 10.01,30.46 v10.67,31.11 | v11.24,37.46 MSD.-
  Bottom 0.203: v11.24,37.46 11.24,31.69 v10.67,31.11
N$47  (via drill 0.3 pad 0.64)
  Top 0.203: U6.12 7.23,32.63 v7.62,33.02 | DAP.- v11.24,38.99
  Bottom 0.203: v11.24,38.99 10.67,38.42 10.67,33.53 10.16,33.02 v7.62,33.02
N$78
  Top 0.203: D1.4 26.67,8.89 23.3,8.89 R4.1
N$79
  Top 0.305: U8.1 25.34,25.08 26.03,25.78 26.03,29.72 Q8.1
N$80
  Top 0.305: R39.2 U8.3
N$81
  Top 0.406: Q5.3 19.69,23.37 R37.2
N$82
  Top 0.406: Q4.3 22.99,23.11 R36.2
N$83
  Top 0.203: Q6.1 23.43,30.8 R41.2 R35.2
N$84
  Top 0.305: Q5.1 20.26,26.73 20.26,27.69 R33.2 20.13,28.26 19.69,28.7 Q7.3
N$85
  Top 0.203: Q7.1 20.13,30.8 R38.2 R42.2
N$86
  Top 0.203: R27.1 15.49,21.97 DONE.+
N$87
  Top 0.203: R28.1 14.99,22.99 CHRG.+
N$88
  Top 0.152: U1.40 16.84,5.98 17.97,7.11 21.4,7.11 R2.2
N$89
  Top 0.152: U1.41 16.8,6.38 17.84,7.43 21.84,7.43 21.91,7.37 R3.2
N$90
  Top 0.152: U1.42 16.75,6.78 17.72,7.75 21.27,7.75 R4.2
N$93
  Top 0.152: J1.2 2.92,5.78 2.92,13.08 3.81,13.97 10.61,13.97 11.18,13.4 11.18,11.56 11.94,10.8 U1.10
N$94
  Top 0.152: J1.3 2.6,8 2.6,13.21 3.68,14.29 10.73,14.29 11.49,13.52 11.49,11.68 12.33,10.84 U1.9
N$95
  Top 0.152: J1.4 2.29,10.22 2.29,13.33 3.56,14.6 10.86,14.6 11.81,13.65 11.81,11.81 12.73,10.89 U1.8
N$96
  Top 0.152: J1.5 1.27,12.76 3.43,14.92 10.99,14.92 12.13,13.78 12.13,11.94 13.13,10.93 U1.7
N$98
  Top 0.406: R39.1 C35.1 R36.1 R34.2 R37.1 R8.1
P12/SDA
  Top 0.203: U1.18 9.47,7.18 8.64,6.35 6.98,6.35 6.98,6.27 | 6.98,6.27 U2.24 | 6.98,6.27 6.98,5.21 R7.2
P13/SCL  (via drill 0.3 pad 0.64)
  Top 0.203: U1.19 9.58,6.78 8.51,5.71 v7.68,5.71 | U2.23 6.47,5.58 v6.4,5.51 5.97,5.08 R6.2
  Bottom 0.203: v6.4,5.51 7.48,5.51 v7.68,5.71
PROG-3V3  (via drill 0.3 pad 0.64)
  Top 0.203: v7.24,25.78 C24.1 7.23,25.28
  Top 0.254: U6.6 10.47,29.96 C23.1 | U6.29 7.23,25.28
  Top 0.305: R41.1 v21.91,31.75 | R24.1 R25.1 R26.1 v15.69,40.64 | 10.48,25.15 R18.2 v9.84,25.27 | v12.13,31.11 11.62,31.11 C23.1 | Q2.2 v1.59,32.38 | C26.2 v23.49,35.56 23.18,35.88 U5.2 | R42.1 18.54,32.77 v18.16,32.38
  pour POWER: -3.17,16.51 -1.91,16.51 -1.91,17.78 -3.17,17.78
  pour POWER (isolate 0.254): 0,17.14 29.84,17.14 29.84,41.91 0,41.91
PROG-!CTS  (via drill 0.3 pad 0.64, 0.51 pad 0.76)
  Top 0.203: U1.14 9.88,8.78 9.65,9.02 9.65,9.78 v9.84,9.97 | U6.16 4.48,31.71 v4.44,31.75
  Bottom 0.203: v9.84,9.97 8.19,9.97 7.62,10.54 7.62,16.45 v7.68,16.51 7.62,16.57 7.62,19.05 4.44,22.22 v4.44,31.75
PROG-!RTS  (via drill 0.3 pad 0.64, 0.51 pad 0.76)
  Top 0.203: U1.16 9.67,7.98 8.89,8.76 8.89,10.67 v9.02,10.79 | U6.30 7.73,26.17 8.13,25.78 8.13,25.21 v8.25,25.08
  Bottom 0.203: v8.25,25.08 8.25,21.21 10.16,19.3 10.16,16.95 v9.72,16.51 9.02,15.81 v9.02,10.79
PROG-BUTTON  (via drill 0.3 pad 0.64)
  Top 0.203: U6.3 10.27,28.46 v10.54,28.19 | v5.72,22.92 4.99,22.92 | SW2.4 SW2.3 4.95,22.91 | 4.99,22.92 4.99,22.91 4.95,22.91 | 4.95,22.91 4.95,22.86 5.08,22.86 5.08,22.99 4.95,22.99 4.95,22.92 | 4.99,22.92 4.95,22.92 | 4.95,22.92 4.95,22.91
  Bottom 0.203: v10.54,28.19 9.02,26.67 6.35,26.67 5.72,26.03 v5.72,22.92
PROG-RESET
  Top 0.203: U6.2 9.92,27.96 10.48,27.41 R18.1 C22.2
PROG-RX  (via drill 0.3 pad 0.64, 0.51 pad 0.76)
  Top 0.203: U1.15 9.78,8.38 9.27,8.89 9.27,10.22 v9.84,10.79 9.78,10.73 | U6.31 8.23,26.25 v8.89,25.59
  Bottom 0.203: v8.89,25.59 8.89,21.21 11.43,18.67 J5.2 11.43,17.21 v10.73,16.51 9.84,15.62 v9.84,10.79
PROG-TX  (via drill 0.3 pad 0.64, 0.51 pad 0.76)
  Top 0.203: U1.17 9.56,7.58 8.51,8.64 8.51,10.48 v8.19,10.79 | U6.32 8.73,26.63 8.99,26.63 v9.46,26.16
  Bottom 0.203: v9.46,26.16 8.47,26.16 7.62,25.31 7.62,19.68 J5.1 8.89,16.7 v8.7,16.51 8.19,16 v8.19,10.79
PROG-VCC  (via drill 0.3 pad 0.64)
  Top 0.406: 21.34,25.4 19.81,25.4 Q5.2 18.8,27.69 | 21.34,25.4 22.1,26.16 Q4.2 21.97,26.54 v21.97,27.69 | 21.34,25.4 21.34,23.24 R34.1 | R29.1 v26.67,29.02 | Q3.P1 18.27,36.43 Q3.6 v17.4,35.56 C31.2 | Q3.4 16.88,37.73 v16.51,38.1 | 18.8,27.69 v18.41,27.69 | R33.1 18.8,27.69 | R32.2 v21.97,27.69 | v21.97,27.69 C32.1
  POWER 0.406: v16.51,38.1 15.88,37.46 15.88,36.2 16.51,35.56 v17.4,35.56 17.4,28.7 v18.41,27.69 | v26.67,29.02 23.3,29.02 v21.97,27.69
  Bottom 0.61: P-VCC.T 16.51,34.67 v17.4,35.56
PRPH-3V3  (via drill 0.3 pad 0.64)
  Top 0.203: 15.88,14.29 C21.1
  Top 0.254: U3.6 15.69,14.1 C21.1 v16.32,14.1
  POWER 0.254: v16.32,14.1 15.11,15.3 2.29,15.3 J1.6
PRPH-PWR-CTL  (via drill 0.3 pad 0.64)
  Top 0.203: U1.3 14.73,11.24 v14.54,11.43 | U3.1 v19.01,13.33 19.01,12.74 19.05,12.7 R12.2
  Bottom 0.203: v19.01,13.33 19.01,11.58 18.22,10.79 15.18,10.79 v14.54,11.43
VBAT_SENSE  (via drill 0.3 pad 0.64)
  Top 0.203: 12.95,12.19 C14.1 13.94,11.02 v13.94,10.79 U1.5 | R14.1 v21.34,13.33 21.34,12.76 R17.2
  Bottom 0.203: v13.94,10.79 14.32,10.41 18.41,10.41 v21.34,13.33
VCC  (via drill 0.3 pad 0.64, 0.51 pad 0.76)
  Top 0.406: BAT1.+ v24.7,12.19 24.7,14.41 24.13,14.99 R14.2 20.45,14.99 | 20.45,14.99 C19.2 20.07,14.99 | 20.33,15.1 20.45,14.99 | U3.2 19.01,14.99 | 19.01,14.99 U3.3 | 20.07,14.99 19.01,14.99 | R8.2 18.03,21.72 18.03,19.43 J9.2 19.88,17.59 v19.88,16.51 19.88,15.18 20.07,14.99
  Bottom 0.203: 25.78,12.19 25.91,12.19 BAT+.1
  Bottom 0.406: v24.7,12.19 25.78,12.19 | J9.1 J9.2
VUSB  (via drill 0.3 pad 0.64)
  Top 0.305: C34.2 7.44,21.22 U7.4 8.75,21.1 8.76,21.08 | U8.5 v25.34,27.56 C33.1
  Top 0.406: R19.1 C27.2 11.75,34.73 11.68,34.67 11.68,34.42 F1.1 11.56,34.16 11.81,34.42 11.81,34.48 | 8.76,21.08 8.76,20.65 9.22,20.19 16.64,20.19 17.21,20.76 R31.1 v17.21,21.47 R27.2 R28.2 v17.21,24.13 | R19.1 14.35,34.8 | Q3.5 v16.57,37.08 15.24,37.08 v14.41,36.26 14.35,36.2 R19.1 | Q3.1 19.49,36.37 19.49,35.18 19.56,35.18 19.81,34.92 U5.3 19.7,34.73 C25.2 v18.41,35.56
  POWER 0.406: v17.21,24.13 16.64,24.7 16.64,34.04 v14.41,36.26 | v16.57,37.08 17.53,37.08 18.41,36.2 v18.41,35.56 | v17.21,21.47 22.1,21.47 25.34,24.7 v25.34,27.56
  Bottom 0.61: VUSB.T 13.97,35.81 v14.41,36.26

### Text on the board
tPlace: - | +
bPlace: SWDIO | SWCLK | RxD | TxD | VCC | VCC | GND | GND | OUT_3V3 | p3 | p4 | BLE Smurf | p5 | v1.02 09/26/2014 | p6 | by Seeed Studio | GND | www.seeedstudio.com